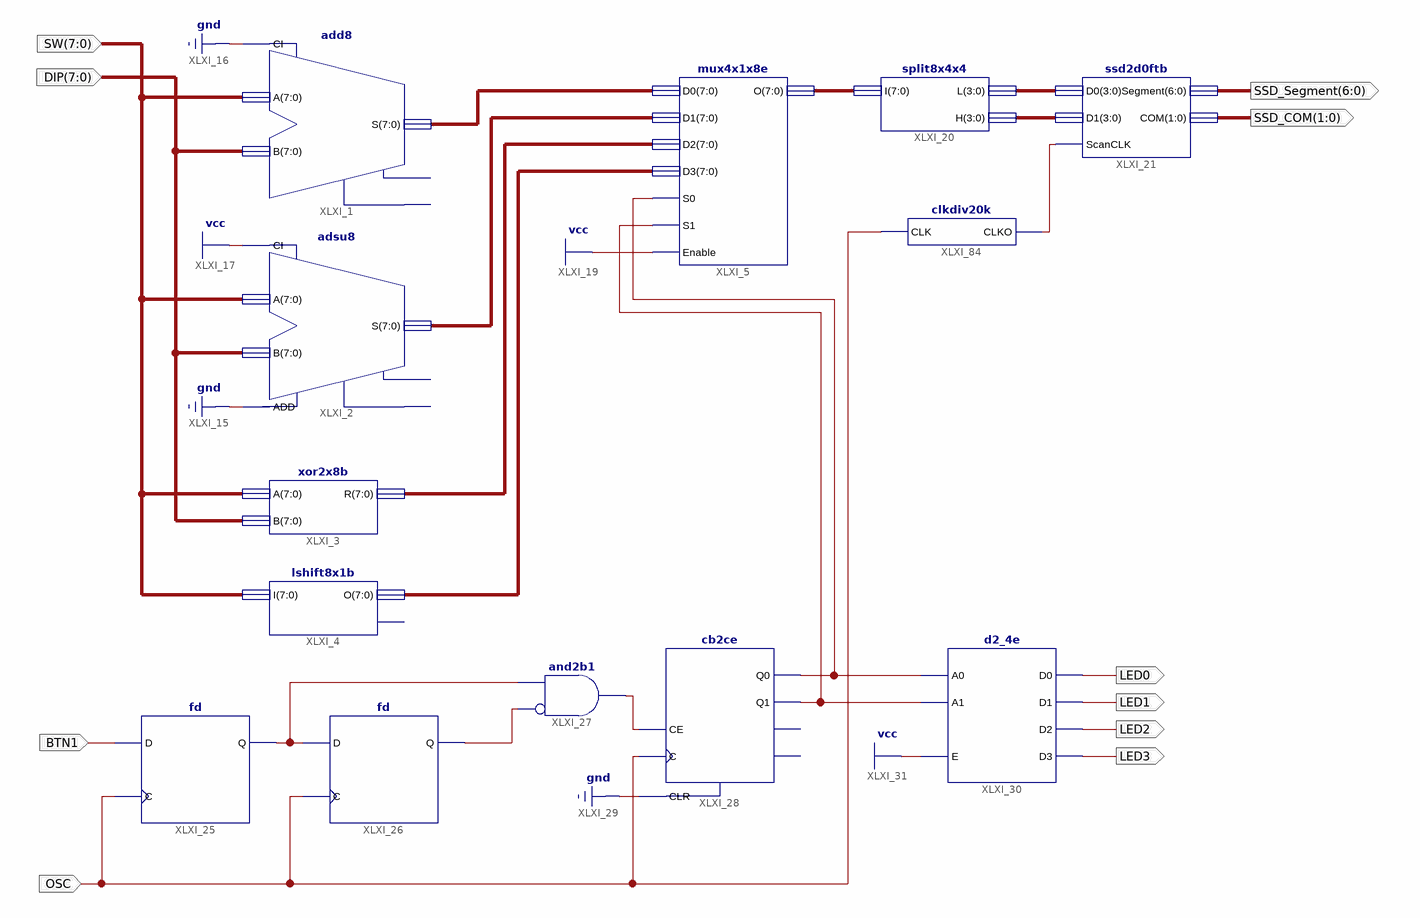
[diagram p0: schematic sheet 1]
// Xilinx ISE schematic main.sch (spartan6) as structural Verilog: 13 symbols, 10 ports
module main (
  input  [7:0] SW,
  input  [7:0] DIP,
  input  OSC,
  input  BTN1,
  output [1:0] SSD_COM,
  output [6:0] SSD_Segment,
  output LED0,
  output LED1,
  output LED2,
  output LED3
);

  wire XLXN_50, XLXN_51, XLXN_55, XLXN_56, XLXN_59, XLXN_103;
  wire [3:0] XLXN_38, XLXN_39;
  wire [7:0] XLXN_5, XLXN_8, XLXN_9, XLXN_34, XLXN_37;

  add8 XLXI_1 (.A(SW), .B(DIP), .CI(1'b0), .S(XLXN_5));  // open: CO, OFL
  adsu8 XLXI_2 (.A(SW), .ADD(1'b0), .B(DIP), .CI(1'b1), .S(XLXN_8));  // open: CO, OFL
  xor2x8b XLXI_3 (.A(SW), .B(DIP), .R(XLXN_9));
  mux4x1x8e XLXI_5 (
    .D0(XLXN_5), .D1(XLXN_8), .D2(XLXN_9), .D3(XLXN_34), .Enable(1'b1), .O(XLXN_37), .S0(XLXN_55),
    .S1(XLXN_56));
  lshift8x1b XLXI_4 (.I(SW), .O(XLXN_34));  // open: OFL
  split8x4x4 XLXI_20 (.H(XLXN_39), .I(XLXN_37), .L(XLXN_38));
  ssd2d0ftb XLXI_21 (.COM(SSD_COM), .D0(XLXN_38), .D1(XLXN_39), .ScanCLK(XLXN_103), .Segment(SSD_Segment));
  fd XLXI_25 (.C(OSC), .D(BTN1), .Q(XLXN_50));
  fd XLXI_26 (.C(OSC), .D(XLXN_50), .Q(XLXN_51));
  cb2ce XLXI_28 (.C(OSC), .CE(XLXN_59), .CLR(1'b0), .Q0(XLXN_55), .Q1(XLXN_56));  // open: CEO, TC
  and XLXI_27 (XLXN_59, ~XLXN_51, XLXN_50);  // and2b1
  d2_4e XLXI_30 (.A0(XLXN_55), .A1(XLXN_56), .E(1'b1), .D0(LED0), .D1(LED1), .D2(LED2), .D3(LED3));
  clkdiv20k XLXI_84 (.CLK(OSC), .CLKO(XLXN_103));
endmodule
